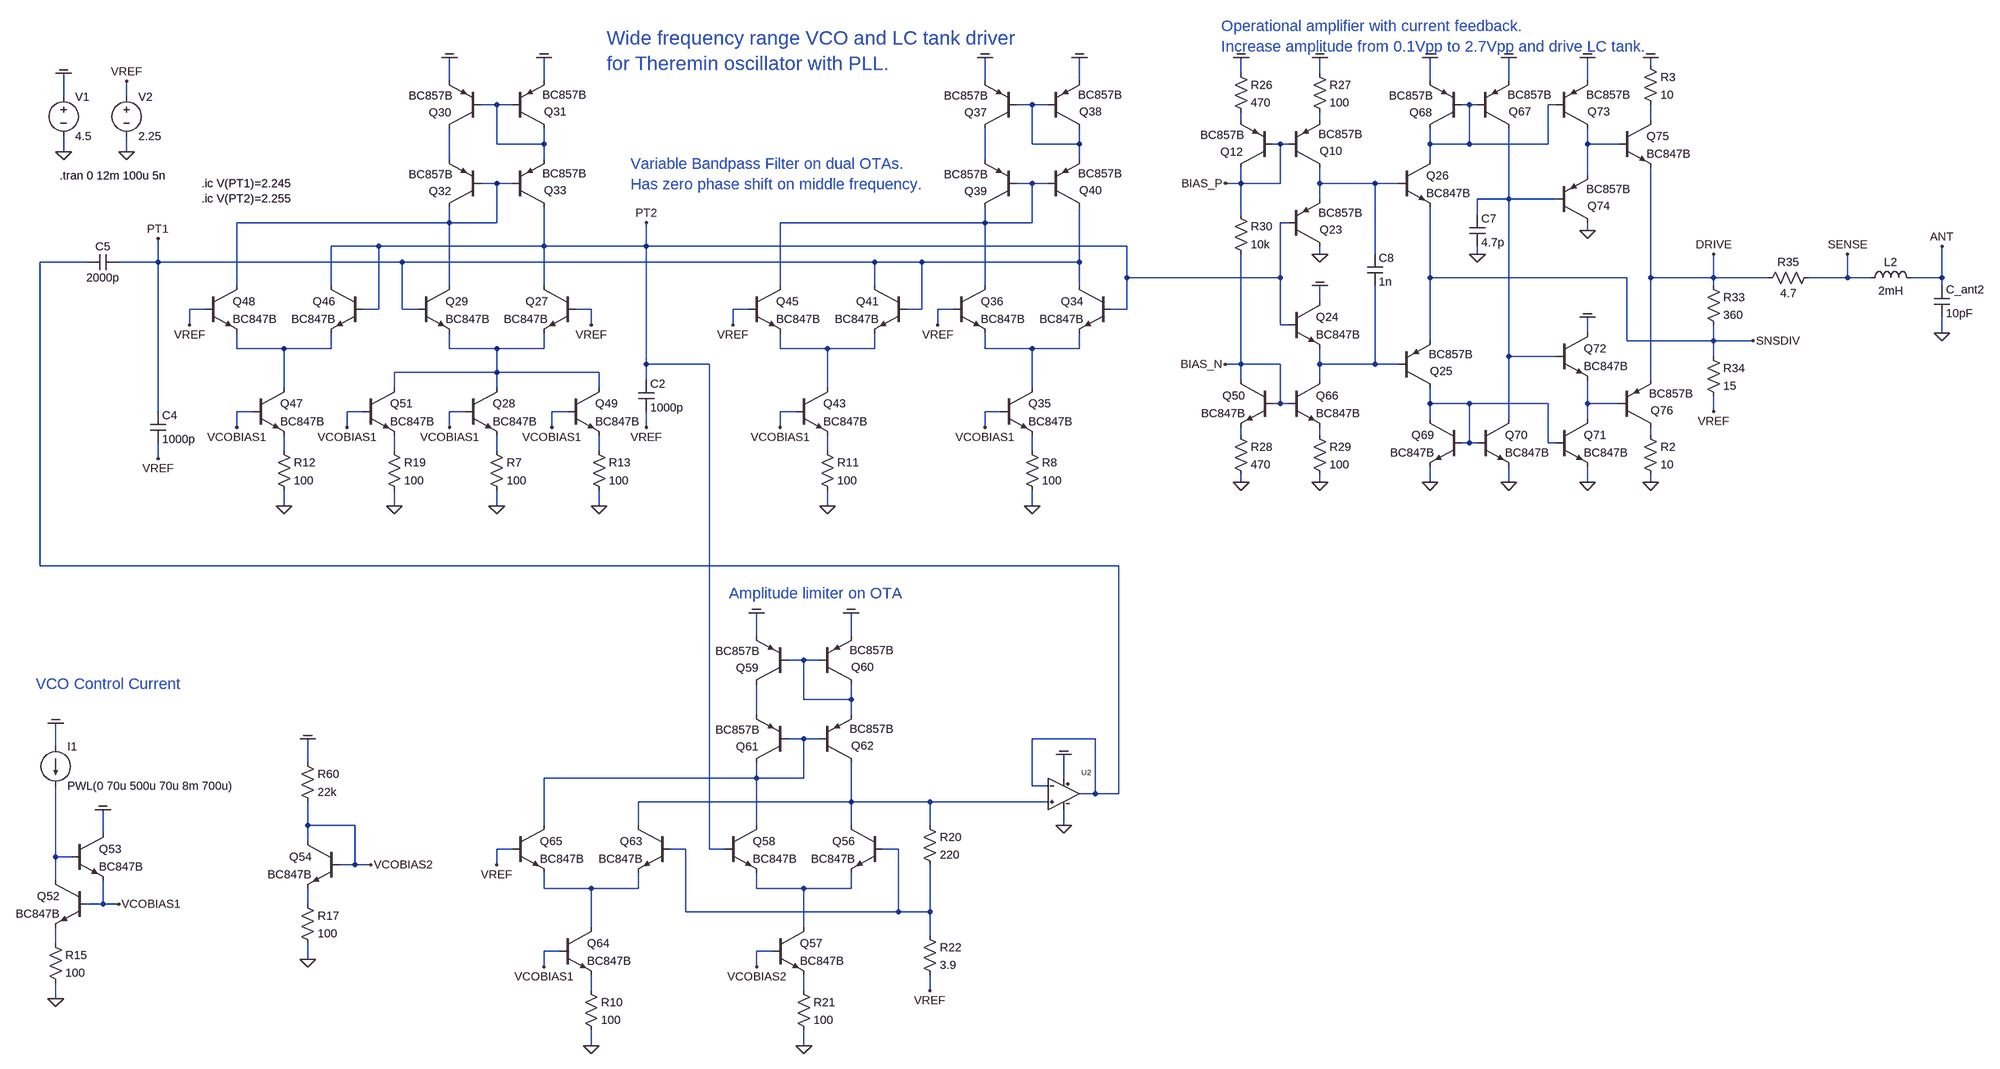
[diagram p0: schematic vco_and_lc_drive_v01.asc]
vco_and_lc_drive_v01.asc, the LTspice schematic file:
Version 4
SHEET 1 13504 21184
WIRE -3280 15776 -3280 15760
WIRE -4112 15792 -4112 15760
WIRE -3952 15792 -3952 15760
WIRE -5792 15808 -5792 15760
WIRE -5600 15808 -5600 15760
WIRE -4704 15808 -4704 15760
WIRE -4512 15808 -4512 15760
WIRE -3728 15808 -3728 15760
WIRE -3568 15808 -3568 15760
WIRE -3408 15808 -3408 15760
WIRE -6576 15840 -6576 15792
WIRE -6448 15840 -6448 15808
WIRE -5696 15856 -5728 15856
WIRE -5664 15856 -5696 15856
WIRE -4608 15856 -4640 15856
WIRE -4576 15856 -4608 15856
WIRE -3648 15856 -3664 15856
WIRE -3632 15856 -3648 15856
WIRE -3472 15856 -3488 15856
WIRE -4112 15888 -4112 15872
WIRE -3952 15888 -3952 15872
WIRE -3280 15888 -3280 15856
WIRE -5696 15936 -5696 15856
WIRE -5600 15936 -5600 15904
WIRE -5600 15936 -5696 15936
WIRE -4608 15936 -4608 15856
WIRE -4512 15936 -4512 15904
WIRE -4512 15936 -4608 15936
WIRE -4032 15936 -4048 15936
WIRE -4016 15936 -4032 15936
WIRE -3728 15936 -3728 15904
WIRE -3648 15936 -3648 15856
WIRE -3648 15936 -3728 15936
WIRE -3488 15936 -3488 15856
WIRE -3488 15936 -3648 15936
WIRE -3408 15936 -3408 15904
WIRE -3344 15936 -3408 15936
WIRE -6576 15952 -6576 15920
WIRE -6448 15952 -6448 15920
WIRE -5792 15968 -5792 15904
WIRE -5600 15968 -5600 15936
WIRE -4704 15968 -4704 15904
WIRE -4512 15968 -4512 15936
WIRE -3728 15968 -3728 15936
WIRE -3408 16000 -3408 15936
WIRE -5696 16016 -5728 16016
WIRE -5664 16016 -5696 16016
WIRE -4608 16016 -4640 16016
WIRE -4576 16016 -4608 16016
WIRE -4112 16016 -4112 15984
WIRE -4112 16016 -4144 16016
WIRE -4032 16016 -4032 15936
WIRE -4032 16016 -4112 16016
WIRE -3952 16016 -3952 15984
WIRE -3840 16016 -3952 16016
WIRE -3792 16016 -3840 16016
WIRE -3952 16048 -3952 16016
WIRE -3568 16048 -3568 15904
WIRE -3568 16048 -3632 16048
WIRE -3472 16048 -3568 16048
WIRE -4112 16080 -4112 16016
WIRE -3632 16080 -3632 16048
WIRE -5792 16096 -5792 16064
WIRE -5792 16096 -6224 16096
WIRE -5696 16096 -5696 16016
WIRE -5696 16096 -5792 16096
WIRE -4704 16096 -4704 16064
WIRE -4704 16096 -5120 16096
WIRE -4608 16096 -4608 16016
WIRE -4608 16096 -4704 16096
WIRE -4016 16096 -4032 16096
WIRE -3408 16112 -3408 16096
WIRE -5936 16144 -6032 16144
WIRE -5600 16144 -5600 16064
WIRE -5600 16144 -5936 16144
WIRE -5392 16144 -5392 16096
WIRE -5392 16144 -5600 16144
WIRE -4416 16144 -5392 16144
WIRE -3952 16160 -3952 16144
WIRE -3840 16160 -3840 16016
WIRE -3632 16160 -3632 16144
WIRE -6528 16176 -6624 16176
WIRE -6384 16176 -6384 16128
WIRE -6384 16176 -6464 16176
WIRE -5888 16176 -6384 16176
WIRE -4928 16176 -5888 16176
WIRE -4832 16176 -4928 16176
WIRE -4512 16176 -4512 16064
WIRE -4512 16176 -4832 16176
WIRE -4416 16208 -4416 16144
WIRE -4032 16208 -4032 16096
WIRE -4032 16208 -4416 16208
WIRE -3728 16208 -3728 16064
WIRE -3328 16208 -3728 16208
WIRE -3280 16208 -3280 15984
WIRE -3152 16208 -3152 16160
WIRE -3152 16208 -3280 16208
WIRE -3040 16208 -3152 16208
WIRE -2880 16208 -2880 16160
WIRE -2880 16208 -2960 16208
WIRE -2832 16208 -2880 16208
WIRE -2688 16208 -2688 16144
WIRE -2688 16208 -2752 16208
WIRE -6224 16224 -6224 16096
WIRE -6032 16224 -6032 16144
WIRE -5792 16224 -5792 16096
WIRE -5600 16224 -5600 16144
WIRE -5120 16224 -5120 16096
WIRE -4928 16224 -4928 16176
WIRE -4704 16224 -4704 16096
WIRE -4512 16224 -4512 16176
WIRE -3152 16224 -3152 16208
WIRE -2688 16224 -2688 16208
WIRE -3952 16256 -3952 16224
WIRE -6288 16272 -6320 16272
WIRE -5936 16272 -5936 16144
WIRE -5936 16272 -5968 16272
WIRE -5888 16272 -5888 16176
WIRE -5856 16272 -5888 16272
WIRE -5504 16272 -5536 16272
WIRE -5184 16272 -5216 16272
WIRE -4832 16272 -4832 16176
WIRE -4832 16272 -4864 16272
WIRE -4768 16272 -4800 16272
WIRE -4416 16272 -4416 16208
WIRE -4416 16272 -4448 16272
WIRE -6320 16304 -6320 16272
WIRE -5504 16304 -5504 16272
WIRE -5216 16304 -5216 16272
WIRE -4800 16304 -4800 16272
WIRE -4032 16304 -4032 16208
WIRE -4016 16304 -4032 16304
WIRE -3408 16320 -3408 16288
WIRE -2688 16320 -2688 16288
WIRE -3728 16336 -3728 16208
WIRE -3328 16336 -3328 16208
WIRE -3152 16336 -3152 16304
WIRE -3152 16336 -3328 16336
WIRE -3072 16336 -3152 16336
WIRE -6224 16352 -6224 16320
WIRE -6128 16352 -6224 16352
WIRE -6032 16352 -6032 16320
WIRE -6032 16352 -6128 16352
WIRE -5792 16352 -5792 16320
WIRE -5696 16352 -5792 16352
WIRE -5600 16352 -5600 16320
WIRE -5600 16352 -5696 16352
WIRE -5120 16352 -5120 16320
WIRE -5024 16352 -5120 16352
WIRE -4928 16352 -4928 16320
WIRE -4928 16352 -5024 16352
WIRE -4704 16352 -4704 16320
WIRE -4608 16352 -4704 16352
WIRE -4512 16352 -4512 16320
WIRE -4512 16352 -4608 16352
WIRE -3568 16368 -3568 16048
WIRE -3472 16368 -3568 16368
WIRE -3152 16368 -3152 16336
WIRE -5392 16384 -5392 16144
WIRE -5264 16384 -5392 16384
WIRE -4112 16384 -4112 16160
WIRE -4112 16384 -4144 16384
WIRE -4032 16384 -4112 16384
WIRE -3952 16384 -3952 16352
WIRE -3840 16384 -3840 16224
WIRE -3840 16384 -3952 16384
WIRE -3792 16384 -3840 16384
WIRE -5696 16400 -5696 16352
WIRE -5696 16400 -5904 16400
WIRE -5488 16400 -5696 16400
WIRE -5392 16416 -5392 16384
WIRE -4112 16416 -4112 16384
WIRE -3952 16416 -3952 16384
WIRE -3280 16416 -3280 16208
WIRE -6128 16432 -6128 16352
WIRE -5904 16432 -5904 16400
WIRE -5696 16432 -5696 16400
WIRE -5488 16432 -5488 16400
WIRE -5024 16432 -5024 16352
WIRE -4608 16432 -4608 16352
WIRE -4032 16464 -4032 16384
WIRE -4032 16464 -4048 16464
WIRE -4016 16464 -4032 16464
WIRE -3728 16464 -3728 16432
WIRE -3648 16464 -3728 16464
WIRE -3488 16464 -3648 16464
WIRE -3408 16464 -3408 16416
WIRE -3344 16464 -3408 16464
WIRE -6384 16480 -6384 16176
WIRE -6192 16480 -6224 16480
WIRE -5968 16480 -6000 16480
WIRE -5760 16480 -5792 16480
WIRE -5552 16480 -5584 16480
WIRE -5088 16480 -5120 16480
WIRE -4672 16480 -4704 16480
WIRE -3152 16480 -3152 16448
WIRE -3728 16496 -3728 16464
WIRE -3568 16496 -3568 16368
WIRE -3408 16496 -3408 16464
WIRE -6224 16512 -6224 16480
WIRE -6000 16512 -6000 16480
WIRE -5792 16512 -5792 16480
WIRE -5584 16512 -5584 16480
WIRE -5392 16512 -5392 16480
WIRE -5120 16512 -5120 16480
WIRE -4704 16512 -4704 16480
WIRE -4112 16528 -4112 16512
WIRE -3952 16528 -3952 16512
WIRE -3280 16528 -3280 16512
WIRE -3648 16544 -3648 16464
WIRE -3648 16544 -3664 16544
WIRE -3632 16544 -3648 16544
WIRE -3488 16544 -3488 16464
WIRE -3472 16544 -3488 16544
WIRE -6128 16560 -6128 16528
WIRE -5904 16560 -5904 16528
WIRE -5696 16560 -5696 16528
WIRE -5488 16560 -5488 16528
WIRE -5024 16560 -5024 16528
WIRE -4608 16560 -4608 16528
WIRE -6384 16576 -6384 16544
WIRE -4112 16624 -4112 16608
WIRE -3952 16624 -3952 16608
WIRE -3728 16624 -3728 16592
WIRE -3568 16624 -3568 16592
WIRE -3408 16624 -3408 16592
WIRE -3280 16624 -3280 16608
WIRE -6128 16672 -6128 16640
WIRE -5904 16672 -5904 16640
WIRE -5696 16672 -5696 16640
WIRE -5488 16672 -5488 16640
WIRE -5024 16672 -5024 16640
WIRE -4608 16672 -4608 16640
WIRE -6624 16800 -6624 16176
WIRE -4432 16800 -6624 16800
WIRE -5168 16944 -5168 16896
WIRE -4976 16944 -4976 16896
WIRE -5072 16992 -5104 16992
WIRE -5040 16992 -5072 16992
WIRE -5072 17072 -5072 16992
WIRE -4976 17072 -4976 17040
WIRE -4976 17072 -5072 17072
WIRE -5168 17104 -5168 17040
WIRE -4976 17104 -4976 17072
WIRE -5072 17152 -5104 17152
WIRE -5040 17152 -5072 17152
WIRE -4480 17152 -4608 17152
WIRE -6592 17168 -6592 17120
WIRE -6080 17200 -6080 17152
WIRE -5168 17232 -5168 17200
WIRE -5168 17232 -5600 17232
WIRE -5072 17232 -5072 17152
WIRE -5072 17232 -5168 17232
WIRE -4544 17232 -4544 17184
WIRE -4608 17248 -4608 17152
WIRE -4576 17248 -4608 17248
WIRE -4480 17264 -4480 17152
WIRE -4480 17264 -4512 17264
WIRE -4432 17264 -4432 16800
WIRE -4432 17264 -4480 17264
WIRE -4976 17280 -4976 17200
WIRE -4976 17280 -5408 17280
WIRE -4816 17280 -4976 17280
WIRE -4576 17280 -4816 17280
WIRE -6080 17328 -6080 17280
WIRE -5984 17328 -6080 17328
WIRE -5600 17328 -5600 17232
WIRE -5408 17328 -5408 17280
WIRE -5168 17328 -5168 17232
WIRE -4976 17328 -4976 17280
WIRE -4816 17328 -4816 17280
WIRE -4544 17328 -4544 17296
WIRE -6496 17344 -6496 17296
WIRE -6080 17360 -6080 17328
WIRE -5664 17376 -5696 17376
WIRE -5312 17376 -5344 17376
WIRE -5264 17376 -5264 16384
WIRE -5232 17376 -5264 17376
WIRE -4880 17376 -4912 17376
WIRE -6592 17392 -6592 17248
WIRE -6560 17392 -6592 17392
WIRE -5984 17408 -5984 17328
WIRE -5984 17408 -6016 17408
WIRE -5952 17408 -5984 17408
WIRE -5696 17408 -5696 17376
WIRE -6592 17440 -6592 17392
WIRE -5600 17456 -5600 17424
WIRE -5504 17456 -5600 17456
WIRE -5408 17456 -5408 17424
WIRE -5408 17456 -5504 17456
WIRE -5168 17456 -5168 17424
WIRE -5072 17456 -5168 17456
WIRE -4976 17456 -4976 17424
WIRE -4976 17456 -5072 17456
WIRE -6496 17488 -6496 17440
WIRE -6496 17488 -6528 17488
WIRE -6464 17488 -6496 17488
WIRE -6080 17488 -6080 17456
WIRE -5312 17504 -5312 17376
WIRE -4880 17504 -4880 17376
WIRE -4880 17504 -5312 17504
WIRE -4816 17504 -4816 17408
WIRE -4816 17504 -4880 17504
WIRE -5504 17536 -5504 17456
WIRE -5072 17536 -5072 17456
WIRE -4816 17552 -4816 17504
WIRE -6592 17568 -6592 17536
WIRE -5568 17584 -5600 17584
WIRE -5136 17584 -5168 17584
WIRE -6080 17600 -6080 17568
WIRE -5600 17616 -5600 17584
WIRE -5168 17616 -5168 17584
WIRE -5504 17664 -5504 17632
WIRE -5072 17664 -5072 17632
WIRE -4816 17664 -4816 17632
WIRE -6592 17680 -6592 17648
WIRE -5504 17776 -5504 17744
WIRE -5072 17776 -5072 17744
FLAG -6576 15952 0
FLAG -6576 15792 COM
FLAG -6448 15952 0
FLAG -6448 15808 VREF
FLAG -6464 17488 VCOBIAS1
FLAG -6080 17152 COM
FLAG -6592 17120 COM
FLAG -5952 17408 VCOBIAS2
FLAG -6496 17296 COM
FLAG -6592 17680 0
FLAG -6080 17600 0
FLAG -5792 16512 VCOBIAS1
FLAG -5696 16672 0
FLAG -5792 15760 COM
FLAG -5600 15760 COM
FLAG -5504 16304 VREF
FLAG -4704 16512 VCOBIAS1
FLAG -4608 16672 0
FLAG -4704 15760 COM
FLAG -4512 15760 COM
FLAG -5392 16512 VREF
FLAG -6384 16576 VREF
FLAG -5120 16512 VCOBIAS1
FLAG -5024 16672 0
FLAG -5216 16304 VREF
FLAG -4800 16304 VREF
FLAG -6224 16512 VCOBIAS1
FLAG -6128 16672 0
FLAG -6320 16304 VREF
FLAG -5584 16512 VCOBIAS1
FLAG -5488 16672 0
FLAG -6000 16512 VCOBIAS1
FLAG -5904 16672 0
FLAG -5168 17616 VCOBIAS2
FLAG -4816 17664 VREF
FLAG -5072 17776 0
FLAG -5168 16896 COM
FLAG -4976 16896 COM
FLAG -4544 17328 0
FLAG -4544 17184 COM
FLAG -5600 17616 VCOBIAS1
FLAG -5504 17776 0
FLAG -5696 17408 VREF
FLAG -6384 16128 PT1
FLAG -5392 16096 PT2
FLAG -4112 16624 0
FLAG -3952 16624 0
FLAG -3952 15760 COM
FLAG -4112 15760 COM
FLAG -3952 16160 0
FLAG -3952 16224 COM
FLAG -4144 16384 BIAS_N
FLAG -4144 16016 BIAS_P
FLAG -3568 15760 COM
FLAG -3728 15760 COM
FLAG -3728 16624 0
FLAG -3568 16624 0
FLAG -3632 16160 0
FLAG -3408 16624 0
FLAG -3408 16288 COM
FLAG -3408 15760 COM
FLAG -3408 16112 0
FLAG -3280 15760 COM
FLAG -3280 16624 0
FLAG -3152 16480 VREF
FLAG -2688 16320 0
FLAG -2688 16144 ANT
FLAG -2880 16160 SENSE
FLAG -3152 16160 DRIVE
FLAG -3072 16336 SNSDIV
SYMBOL voltage -6576 15824 R0
SYMATTR InstName V1
SYMATTR Value 4.5
SYMBOL Voltage -6448 15824 R0
SYMATTR InstName V2
SYMATTR Value 2.25
SYMBOL npn -6528 17440 M0
SYMATTR InstName Q52
SYMATTR Value BC847B
SYMBOL Res -6096 17184 R0
SYMATTR InstName R60
SYMATTR Value 22k
SYMBOL current -6592 17168 R0
SYMATTR InstName I1
SYMATTR Value PWL(0 70u 500u 70u 8m 700u)
SYMBOL npn -6016 17360 M0
SYMATTR InstName Q54
SYMATTR Value BC847B
SYMBOL npn -6560 17344 R0
SYMATTR InstName Q53
SYMATTR Value BC847B
SYMBOL Res -6608 17552 R0
SYMATTR InstName R15
SYMATTR Value 100
SYMBOL Res -6096 17472 R0
SYMATTR InstName R17
SYMATTR Value 100
SYMBOL npn -5536 16224 M0
SYMATTR InstName Q27
SYMATTR Value BC847B
SYMBOL npn -5760 16432 R0
SYMATTR InstName Q28
SYMATTR Value BC847B
SYMBOL npn -5856 16224 R0
SYMATTR InstName Q29
SYMATTR Value BC847B
SYMBOL Res -5712 16544 R0
SYMATTR InstName R7
SYMATTR Value 100
SYMBOL pnp -5728 15904 R180
WINDOW 0 60 32 Left 2
WINDOW 3 58 66 Left 2
SYMATTR InstName Q30
SYMATTR Value BC857B
SYMBOL pnp -5664 15904 M180
WINDOW 0 64 34 Left 2
WINDOW 3 61 68 Left 2
SYMATTR InstName Q31
SYMATTR Value BC857B
SYMBOL pnp -5728 16064 R180
WINDOW 0 60 32 Left 2
WINDOW 3 58 66 Left 2
SYMATTR InstName Q32
SYMATTR Value BC857B
SYMBOL pnp -5664 16064 M180
WINDOW 0 64 34 Left 2
WINDOW 3 61 68 Left 2
SYMATTR InstName Q33
SYMATTR Value BC857B
SYMBOL npn -4448 16224 M0
SYMATTR InstName Q34
SYMATTR Value BC847B
SYMBOL npn -4672 16432 R0
SYMATTR InstName Q35
SYMATTR Value BC847B
SYMBOL npn -4768 16224 R0
SYMATTR InstName Q36
SYMATTR Value BC847B
SYMBOL Res -4624 16544 R0
SYMATTR InstName R8
SYMATTR Value 100
SYMBOL pnp -4640 15904 R180
WINDOW 0 60 32 Left 2
WINDOW 3 58 66 Left 2
SYMATTR InstName Q37
SYMATTR Value BC857B
SYMBOL pnp -4576 15904 M180
WINDOW 0 64 34 Left 2
WINDOW 3 61 68 Left 2
SYMATTR InstName Q38
SYMATTR Value BC857B
SYMBOL pnp -4640 16064 R180
WINDOW 0 60 32 Left 2
WINDOW 3 58 66 Left 2
SYMATTR InstName Q39
SYMATTR Value BC857B
SYMBOL pnp -4576 16064 M180
WINDOW 0 64 34 Left 2
WINDOW 3 61 68 Left 2
SYMATTR InstName Q40
SYMATTR Value BC857B
SYMBOL Cap -5408 16416 R0
SYMATTR InstName C2
SYMATTR Value 1000p
SYMBOL Cap -6400 16480 R0
SYMATTR InstName C4
SYMATTR Value 1000p
SYMBOL Cap -6464 16160 R90
WINDOW 0 0 32 VBottom 2
WINDOW 3 32 32 VTop 2
SYMATTR InstName C5
SYMATTR Value 2000p
SYMBOL npn -4864 16224 M0
SYMATTR InstName Q41
SYMATTR Value BC847B
SYMBOL npn -5088 16432 R0
SYMATTR InstName Q43
SYMATTR Value BC847B
SYMBOL npn -5184 16224 R0
SYMATTR InstName Q45
SYMATTR Value BC847B
SYMBOL Res -5040 16544 R0
SYMATTR InstName R11
SYMATTR Value 100
SYMBOL npn -5968 16224 M0
SYMATTR InstName Q46
SYMATTR Value BC847B
SYMBOL npn -6192 16432 R0
SYMATTR InstName Q47
SYMATTR Value BC847B
SYMBOL npn -6288 16224 R0
SYMATTR InstName Q48
SYMATTR Value BC847B
SYMBOL Res -6144 16544 R0
SYMATTR InstName R12
SYMATTR Value 100
SYMBOL npn -5552 16432 R0
SYMATTR InstName Q49
SYMATTR Value BC847B
SYMBOL Res -5504 16544 R0
SYMATTR InstName R13
SYMATTR Value 100
SYMBOL npn -5968 16432 R0
SYMATTR InstName Q51
SYMATTR Value BC847B
SYMBOL Res -5920 16544 R0
SYMATTR InstName R19
SYMATTR Value 100
SYMBOL npn -4912 17328 M0
SYMATTR InstName Q56
SYMATTR Value BC847B
SYMBOL npn -5136 17536 R0
SYMATTR InstName Q57
SYMATTR Value BC847B
SYMBOL npn -5232 17328 R0
SYMATTR InstName Q58
SYMATTR Value BC847B
SYMBOL Res -4832 17312 R0
SYMATTR InstName R20
SYMATTR Value 220
SYMBOL Res -5088 17648 R0
SYMATTR InstName R21
SYMATTR Value 100
SYMBOL Res -4832 17536 R0
SYMATTR InstName R22
SYMATTR Value 3.9
SYMBOL pnp -5104 17040 R180
WINDOW 0 60 32 Left 2
WINDOW 3 58 66 Left 2
SYMATTR InstName Q59
SYMATTR Value BC857B
SYMBOL pnp -5040 17040 M180
WINDOW 0 64 34 Left 2
WINDOW 3 61 68 Left 2
SYMATTR InstName Q60
SYMATTR Value BC857B
SYMBOL pnp -5104 17200 R180
WINDOW 0 60 32 Left 2
WINDOW 3 58 66 Left 2
SYMATTR InstName Q61
SYMATTR Value BC857B
SYMBOL pnp -5040 17200 M180
WINDOW 0 64 34 Left 2
WINDOW 3 61 68 Left 2
SYMATTR InstName Q62
SYMATTR Value BC857B
SYMBOL MCP6021 -4544 17264 R0
SYMATTR InstName U2
SYMBOL npn -5344 17328 M0
SYMATTR InstName Q63
SYMATTR Value BC847B
SYMBOL npn -5568 17536 R0
SYMATTR InstName Q64
SYMATTR Value BC847B
SYMBOL npn -5664 17328 R0
SYMATTR InstName Q65
SYMATTR Value BC847B
SYMBOL Res -5520 17648 R0
SYMATTR InstName R10
SYMATTR Value 100
SYMBOL pnp -4016 15984 M180
WINDOW 0 64 34 Left 2
WINDOW 3 61 68 Left 2
SYMATTR InstName Q10
SYMATTR Value BC857B
SYMBOL pnp -4048 15984 R180
WINDOW 0 60 32 Left 2
WINDOW 3 58 66 Left 2
SYMATTR InstName Q12
SYMATTR Value BC857B
SYMBOL pnp -4016 16144 M180
WINDOW 0 64 34 Left 2
WINDOW 3 61 68 Left 2
SYMATTR InstName Q23
SYMATTR Value BC857B
SYMBOL npn -4016 16256 R0
SYMATTR InstName Q24
SYMATTR Value BC847B
SYMBOL pnp -3792 16432 M180
WINDOW 0 64 34 Left 2
WINDOW 3 61 68 Left 2
SYMATTR InstName Q25
SYMATTR Value BC857B
SYMBOL npn -3792 15968 R0
SYMATTR InstName Q26
SYMATTR Value BC847B
SYMBOL Res -4128 15776 R0
SYMATTR InstName R26
SYMATTR Value 470
SYMBOL Res -3968 15776 R0
SYMATTR InstName R27
SYMATTR Value 100
SYMBOL Res -4128 16512 R0
SYMATTR InstName R28
SYMATTR Value 470
SYMBOL Res -3968 16512 R0
SYMATTR InstName R29
SYMATTR Value 100
SYMBOL npn -4048 16416 M0
SYMATTR InstName Q50
SYMATTR Value BC847B
SYMBOL npn -4016 16416 R0
SYMATTR InstName Q66
SYMATTR Value BC847B
SYMBOL Res -4128 16064 R0
SYMATTR InstName R30
SYMATTR Value 10k
SYMBOL pnp -3632 15904 M180
WINDOW 0 64 34 Left 2
WINDOW 3 61 68 Left 2
SYMATTR InstName Q67
SYMATTR Value BC857B
SYMBOL pnp -3664 15904 R180
WINDOW 0 60 32 Left 2
WINDOW 3 58 66 Left 2
SYMATTR InstName Q68
SYMATTR Value BC857B
SYMBOL npn -3664 16496 M0
SYMATTR InstName Q69
SYMATTR Value BC847B
SYMBOL npn -3632 16496 R0
SYMATTR InstName Q70
SYMATTR Value BC847B
SYMBOL Cap -3648 16080 R0
SYMATTR InstName C7
SYMATTR Value 4.7p
SYMBOL npn -3472 16496 R0
SYMATTR InstName Q71
SYMATTR Value BC847B
SYMBOL npn -3472 16320 R0
SYMATTR InstName Q72
SYMATTR Value BC847B
SYMBOL pnp -3472 15904 M180
WINDOW 0 64 34 Left 2
WINDOW 3 61 68 Left 2
SYMATTR InstName Q73
SYMATTR Value BC857B
SYMBOL pnp -3472 16096 M180
WINDOW 0 64 34 Left 2
WINDOW 3 61 68 Left 2
SYMATTR InstName Q74
SYMATTR Value BC857B
SYMBOL npn -3344 15888 R0
SYMATTR InstName Q75
SYMATTR Value BC847B
SYMBOL pnp -3344 16512 M180
WINDOW 0 64 34 Left 2
WINDOW 3 61 68 Left 2
SYMATTR InstName Q76
SYMATTR Value BC857B
SYMBOL Res -3168 16208 R0
SYMATTR InstName R33
SYMATTR Value 360
SYMBOL Res -3168 16352 R0
SYMATTR InstName R34
SYMATTR Value 15
SYMBOL ind -2848 16224 R270
WINDOW 0 32 56 VTop 2
WINDOW 3 5 56 VBottom 2
SYMATTR InstName L2
SYMATTR Value 2mH
SYMATTR SpiceLine Rser=120 Cpar=1pF
SYMBOL Cap -2704 16224 R0
SYMATTR InstName C_ant2
SYMATTR Value 10pF
SYMBOL Res -3056 16224 R270
WINDOW 0 32 56 VTop 2
WINDOW 3 0 56 VBottom 2
SYMATTR InstName R35
SYMATTR Value 4.7
SYMBOL Cap -3856 16160 R0
SYMATTR InstName C8
SYMATTR Value 1n
SYMBOL Res -3296 16512 R0
SYMATTR InstName R2
SYMATTR Value 10
SYMBOL Res -3296 15760 R0
SYMATTR InstName R3
SYMATTR Value 10
TEXT -6584 16000 Left 2 !.tran 0 12m 100u 5n
TEXT -5472 15720 Left 4 ;Wide frequency range VCO and LC tank driver \nfor Theremin oscillator with PLL.
TEXT -6296 16016 Left 2 !.ic V(PT1)=2.245\n.ic V(PT2)=2.255
TEXT -4152 15696 Left 3 ;Operational amplifier with current feedback.\nIncrease amplitude from 0.1Vpp to 2.7Vpp and drive LC tank.
TEXT -5224 16856 Left 3 ;Amplitude limiter on OTA
TEXT -5424 15976 Left 3 ;Variable Bandpass Filter on dual OTAs.\nHas zero phase shift on middle frequency.
TEXT -6632 17040 Left 3 ;VCO Control Current

The netlist it stands for:
* vco_and_lc_drive_v01.asc
V1 COM 0 4.5
V2 VREF 0 2.25
Q52 N036 VCOBIAS1 N040 0 BC847B
R60 COM VCOBIAS2 22k
I1 COM N036 PWL(0 70u 500u 70u 8m 700u)
Q54 VCOBIAS2 VCOBIAS2 N039 0 BC847B
Q53 COM N036 VCOBIAS1 0 BC847B
R15 N040 0 100
R17 N039 0 100
Q27 PT2 VREF N016 0 BC847B
Q28 N016 VCOBIAS1 N027 0 BC847B
Q29 N010 PT1 N016 0 BC847B
R7 N027 0 100
Q30 N008 N001 COM 0 BC857B
Q31 N001 N001 COM 0 BC857B
Q32 N010 N010 N008 0 BC857B
Q33 PT2 N010 N001 0 BC857B
Q34 PT1 PT2 N018 0 BC847B
Q35 N018 VCOBIAS1 N030 0 BC847B
Q36 N011 VREF N018 0 BC847B
R8 N030 0 100
Q37 N009 N002 COM 0 BC857B
Q38 N002 N002 COM 0 BC857B
Q39 N011 N011 N009 0 BC857B
Q40 PT1 N011 N002 0 BC857B
C2 PT2 VREF 1000p
C4 PT1 VREF 1000p
C5 PT1 N014 2000p
Q41 PT1 PT1 N017 0 BC847B
Q43 N017 VCOBIAS1 N029 0 BC847B
Q45 N011 VREF N017 0 BC847B
R11 N029 0 100
Q46 PT2 PT2 N015 0 BC847B
Q47 N015 VCOBIAS1 N025 0 BC847B
Q48 N010 VREF N015 0 BC847B
R12 N025 0 100
Q49 N016 VCOBIAS1 N028 0 BC847B
R13 N028 0 100
Q51 N016 VCOBIAS1 N026 0 BC847B
R19 N026 0 100
Q56 N034 N035 N038 0 BC847B
Q57 N038 VCOBIAS2 N042 0 BC847B
Q58 N033 PT2 N038 0 BC847B
R20 N034 N035 220
R21 N042 0 100
R22 N035 VREF 3.9
Q59 N032 N031 COM 0 BC857B
Q60 N031 N031 COM 0 BC857B
Q61 N033 N033 N032 0 BC857B
Q62 N034 N033 N031 0 BC857B
XU2 N034 N014 COM 0 N014 MCP6021  ; pins In+ In- V+ V- OUT
Q63 N034 N035 N037 0 BC847B
Q64 N037 VCOBIAS1 N041 0 BC847B
Q65 N033 VREF N037 0 BC847B
R10 N041 0 100
Q10 N012 BIAS_P N005 0 BC857B
Q12 BIAS_P BIAS_P N004 0 BC857B
Q23 0 PT2 N012 0 BC857B
Q24 COM PT2 N019 0 BC847B
Q25 N020 N019 SNSDIV 0 BC857B
Q26 N003 N012 SNSDIV 0 BC847B
R26 COM N004 470
R27 COM N005 100
R28 N022 0 470
R29 N023 0 100
Q50 BIAS_N BIAS_N N022 0 BC847B
Q66 N019 BIAS_N N023 0 BC847B
R30 BIAS_P BIAS_N 10k
Q67 N013 N003 COM 0 BC857B
Q68 N003 N003 COM 0 BC857B
Q69 N020 N020 0 0 BC847B
Q70 N013 N020 0 0 BC847B
C7 N013 0 4.7p
Q71 N021 N020 0 0 BC847B
Q72 COM N013 N021 0 BC847B
Q73 N007 N003 COM 0 BC857B
Q74 0 N013 N007 0 BC857B
Q75 N006 N007 DRIVE 0 BC847B
Q76 N024 N021 DRIVE 0 BC857B
R33 DRIVE SNSDIV 360
R34 SNSDIV VREF 15
L2 SENSE ANT 2mH Rser=120 Cpar=1pF
C_ant2 ANT 0 10pF
R35 DRIVE SENSE 4.7
C8 N012 N019 1n
R2 N024 0 10
R3 COM N006 10
.model NPN NPN
.model PNP PNP
.lib standard.bjt
.tran 0 12m 100u 5n
* Wide frequency range VCO and LC tank driver
* for Theremin oscillator with PLL.
.ic V(PT1)=2.245
.ic V(PT2)=2.255
* Operational amplifier with current feedback.
* Increase amplitude from 0.1Vpp to 2.7Vpp and drive LC tank.
* Amplitude limiter on OTA
* Variable Bandpass Filter on dual OTAs.
* Has zero phase shift on middle frequency.
* VCO Control Current
.lib MCP6021.cir
.backanno
.end